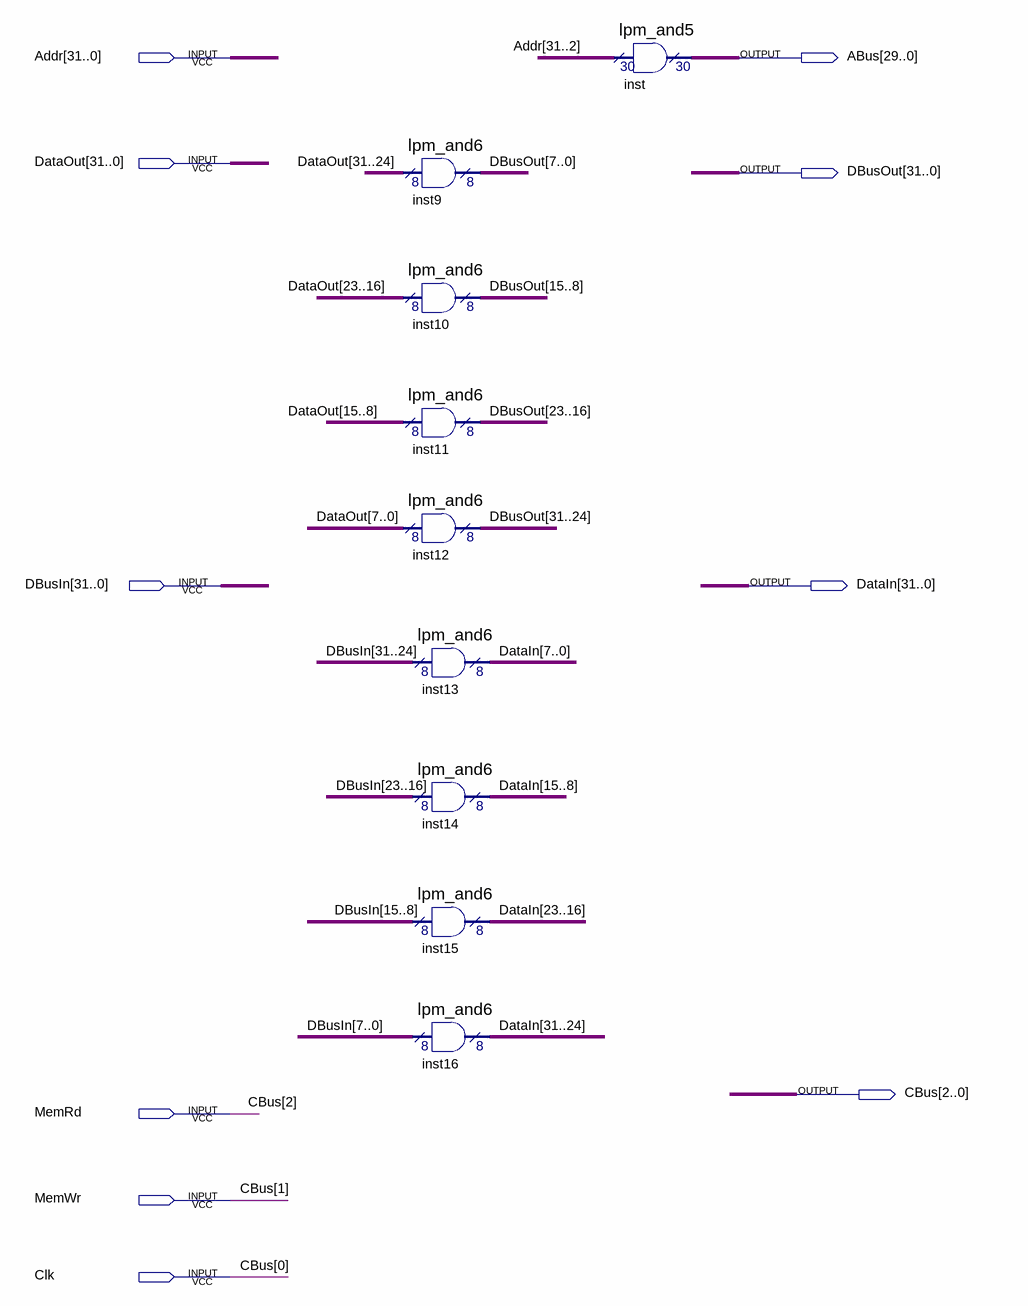
[diagram p0: schematic sheet]
// Quartus schematic DBIU.bdf as structural Verilog: 9 symbols, 10 pins
module DBIU (
  input  [31:0] Addr,
  input  [31:0] DataOut,
  input  [31:0] DBusIn,
  input  MemRd,
  input  MemWr,
  input  Clk,
  output [29:0] ABus,
  output [31:0] DBusOut,
  output [31:0] DataIn,
  output [2:0] CBus
);

  lpm_and6 inst9 (.data0x(DataOut[31:24]), .result(DBusOut[7:0]));
  lpm_and6 inst10 (.data0x(DataOut[23:16]), .result(DBusOut[15:8]));
  lpm_and6 inst11 (.data0x(DataOut[15:8]), .result(DBusOut[23:16]));
  lpm_and6 inst12 (.data0x(DataOut[7:0]), .result(DBusOut[31:24]));
  lpm_and6 inst13 (.data0x(DBusIn[31:24]), .result(DataIn[7:0]));
  lpm_and6 inst14 (.data0x(DBusIn[23:16]), .result(DataIn[15:8]));
  lpm_and6 inst15 (.data0x(DBusIn[15:8]), .result(DataIn[23:16]));
  lpm_and6 inst16 (.data0x(DBusIn[7:0]), .result(DataIn[31:24]));
  lpm_and5 inst (.data0x(Addr[31:2]), .result(ABus));

  assign CBus = {MemRd, MemWr, Clk};
endmodule
